# Altium project Injection_PCB.PrjPcb
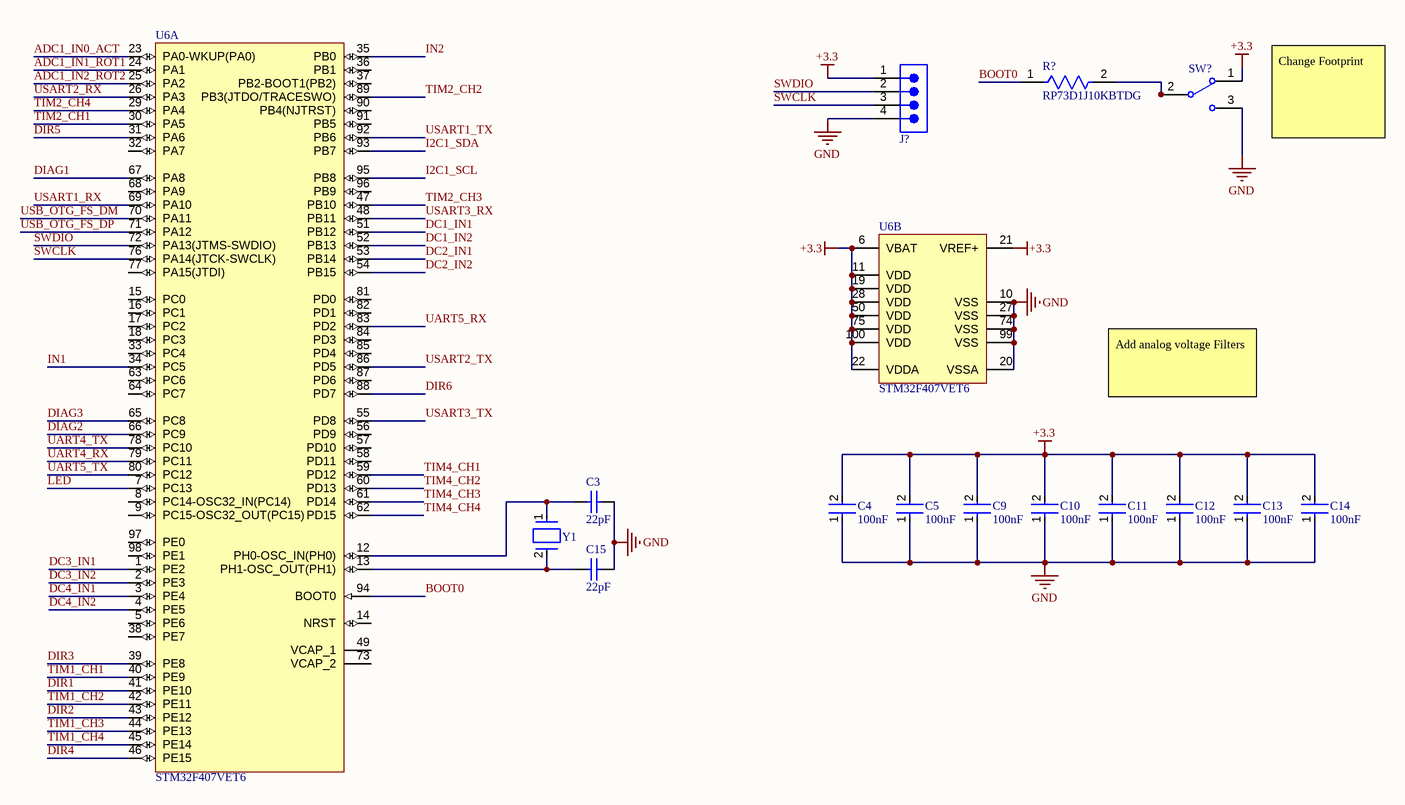
[diagram p0: MCU.SchDoc]
4 sheets, 79 parts. Net scope: global (net labels, ports and power ports of the same name join across sheets).
Board file: Injection_PCB.PcbDoc
Sheets:
  MCU.SchDoc
  Power.SchDoc
  Motor_Drivers.SchDoc
  Encoders.SchDoc

## Sheet MCU.SchDoc
size 431 x 279 mm; SheetNumber: 1; SheetTotal: 4

### Parts
C3  Capacitance: 22pF  [CAPC1608X90X35ML10T15]  (hidden comment: GRM1885C1H220JA01D)
C4  Capacitance: 100nF  [FP-CGA3E-0_3-0_1-IPC_A]  (hidden comment: CGA3E2X7R1H104K080AA)
C5  Capacitance: 100nF  [FP-CGA3E-0_3-0_1-IPC_A]  (hidden comment: CGA3E2X7R1H104K080AA)
C9  Capacitance: 100nF  [FP-CGA3E-0_3-0_1-IPC_A]  (hidden comment: CGA3E2X7R1H104K080AA)
C10  Capacitance: 100nF  [FP-CGA3E-0_3-0_1-IPC_A]  (hidden comment: CGA3E2X7R1H104K080AA)
C11  Capacitance: 100nF  [FP-CGA3E-0_3-0_1-IPC_A]  (hidden comment: CGA3E2X7R1H104K080AA)
C12  Capacitance: 100nF  [FP-CGA3E-0_3-0_1-IPC_A]  (hidden comment: CGA3E2X7R1H104K080AA)
C13  Capacitance: 100nF  [FP-CGA3E-0_3-0_1-IPC_A]  (hidden comment: CGA3E2X7R1H104K080AA)
C14  Capacitance: 100nF  [FP-CGA3E-0_3-0_1-IPC_A]  (hidden comment: CGA3E2X7R1H104K080AA)
C15  Capacitance: 22pF  [CAPC1608X90X35ML10T15]  (hidden comment: GRM1885C1H220JA01D)
J?  61300411121  [61300411121]  (value not drawn)
R?  RP73D1J10KBTDG  [FP-RP731J-MFG]
SW?  EG1218  [ESWI-EG1218_V]  (value not drawn)
U6  STM32F407VET6  [STM-LQFP100_M]  (parts A,B of 2)
Y1  ABLS-8.000MHZ-B2-T  [FP-ABLS-MFG]  (value not drawn)

### Nets
+3.3: C4.2 C5.2 C9.2 C10.2 C11.2 C12.2 C13.2 C14.2 J?.1 SW?.1 U6.6(VBAT) U6.11(VDD) U6.19(VDD) U6.21(VREF+) U6.22(VDDA) U6.28(VDD) U6.50(VDD) U6.75(VDD) U6.100(VDD)
GND: C3.1 C4.1 C5.1 C9.1 C10.1 C11.1 C12.1 C13.1 C14.1 C15.1 J?.4 SW?.3 U6.10(VSS) U6.20(VSSA) U6.27(VSS) U6.74(VSS) U6.99(VSS)
ADC1_IN0_ACT: U6.23(PA0-WKUP(PA0))
ADC1_IN1_ROT1: U6.24(PA1)
ADC1_IN2_ROT2: U6.25(PA2)
BOOT0: R?.1 U6.94(BOOT0)
DC1_IN1: U6.51(PB12)
DC1_IN2: U6.52(PB13)
DC2_IN1: U6.53(PB14)
DC2_IN2: U6.54(PB15)
DC3_IN1: U6.1(PE2)
DC3_IN2: U6.2(PE3)
DC4_IN1: U6.3(PE4)
DC4_IN2: U6.4(PE5)
DIAG1: U6.67(PA8)
DIAG2: U6.66(PC9)
DIAG3: U6.65(PC8)
DIR1: U6.41(PE10)
DIR2: U6.43(PE12)
DIR3: U6.39(PE8)
DIR4: U6.46(PE15)
DIR5: U6.31(PA6)
DIR6: U6.88(PD7)
I2C1_SCL: U6.95(PB8)
I2C1_SDA: U6.93(PB7)
IN1: U6.34(PC5)
IN2: U6.35(PB0)
LED: U6.7(PC13)
SWCLK: J?.3 U6.76(PA14(JTCK-SWCLK))
SWDIO: J?.2 U6.72(PA13(JTMS-SWDIO))
TIM1_CH1: U6.40(PE9)
TIM1_CH2: U6.42(PE11)
TIM1_CH3: U6.44(PE13)
TIM1_CH4: U6.45(PE14)
TIM2_CH1: U6.30(PA5)
TIM2_CH2: U6.89(PB3(JTDO/TRACESWO))
TIM2_CH3: U6.47(PB10)
TIM2_CH4: U6.29(PA4)
TIM4_CH1: U6.59(PD12)
TIM4_CH2: U6.60(PD13)
TIM4_CH3: U6.61(PD14)
TIM4_CH4: U6.62(PD15)
UART4_RX: U6.79(PC11)
UART4_TX: U6.78(PC10)
UART5_RX: U6.83(PD2)
UART5_TX: U6.80(PC12)
USART1_RX: U6.69(PA10)
USART1_TX: U6.92(PB6)
USART2_RX: U6.26(PA3)
USART2_TX: U6.86(PD5)
USART3_RX: U6.48(PB11)
USART3_TX: U6.55(PD8)
USB_OTG_FS_DM: U6.70(PA11)
USB_OTG_FS_DP: U6.71(PA12)
NetC3_2: C3.2 U6.12(PH0-OSC_IN(PH0)) Y1.1
NetC15_2: C15.2 U6.13(PH1-OSC_OUT(PH1)) Y1.2
NetR?_2: R?.2 SW?.2(COM)

Not connected (* = marked no-connect by the designer): U6 5(PE6) 8(PC14-OSC32_IN(PC14)) 9(PC15-OSC32_OUT(PC15)) 14(NRST) 15(PC0) 16(PC1) 17(PC2) 18(PC3) 32(PA7) 33(PC4) 36(PB1) 37(PB2-BOOT1(PB2)) 38(PE7) 49(VCAP_1) 56(PD9) 57(PD10) 58(PD11) 63(PC6) 64(PC7) 68(PA9) 73(VCAP_2) 77(PA15(JTDI)) 81(PD0) 82(PD1) 84(PD3) 85(PD4) 87(PD6) 90(PB4(NJTRST)) 91(PB5) 96(PB9) 97(PE0) 98(PE1)

### Notes on the sheet
- Change Footprint
- Add analog voltage Filters
- DWG. NO.
- REV.
- SHT.
- THIS DOCUMENT AND THE DATA DISCLOSED HEREIN OR HEREWITH IS THE PROPERTY OF ALTIUM LIMITED AND MAY BE FREELY DISTRIBUTED IN WHOLE. NO RIGHTS ARE RESERVED OR EXPRESS OR IMPLIED WARANTEE GIVEN.
- REVISION
- DESCRIPTION
- DATE
- APPROVED
- ENG:
- APPROVALS
- PROJECT
- DSN:
- CHK:
- REFERENCE DOCUMENTS
- PROJECT REVISION:
- TITLE
- DOCUMENT REVISION:
- DESIGN ITEM:
- BOM:
- FAB DWG:
- PCB DWG:
- ASSY DWG:
- SCALE:
- SIZE
- B
- CAGE CODE
- FILE NAME
- DWG NO.
- SHEET
- OF
- REV

### Library data of the parts
C3 C15 = CMP-2000-04945-1: Chip Capacitor, 22 pF, +/- 5%, 50 V, -55 to 125 degC, 0603 (1608 Metric), RoHS, Tape and Reel; Manufacturer: Murata; Rated Voltage: 50V; Dielectric: C0G; Manufacturer URL: http://www.murata.com/; Datasheet Version: Jul-06; Package Reference: 603; Tolerance (%): ±5%; Case Size/Dimension: 0603; Package Description: 2-Pin Surface Mount Device, Body 1.6 x 0.8 mm; Datasheet URL: https://datasheet.ciiva.com/11786/0900766b807a1cab-11786398.pdf
C4 C5 C9-C14 = CMP-2000-07546-2: Cap Ceramic 100nF 50V X7R 10% Pad SMD 0603 +125°C Automotive T/R; Weight: 7.1E-05oz; Composition: Ceramic; Max Operating Temperature: 125°C; Termination: SMD/SMT; Dielectric: X7R; Length: 1.6mm; Package Quantity: 1; REACH SVHC: No SVHC; Lead Free: Lead Free; Case Code (Metric): 1608; Min Operating Temperature: -55°C; Packaging: Tape and Reel; Tolerance: 10%; Voltage Rating: 50V; Case Code (Imperial): 0603; Case/Package: 0603; Voltage Rating (DC): 50V; Depth: 0.8mm; Radiation Hardening: No; Ratings: AEC-Q200; Mount: Surface Mount; Voltage: 50V; Thickness: 0.035inch; Width: 0.8mm; Height: 0.8mm; LCSC: C14663
J? = CMP-1502-01064-3: NexarPartId: 32855522; Operating Supply Voltage: 250V; Pitch: 2.54mm; Contact Resistance: 20mΩ; Number of Positions: 4; Current Rating: 3A; Connector Type: Male Pin; Gender: Male; Contact Plating: Gold; Height: 8.89mm; Lead Pitch: 2.54mm; Lead Free: Lead Free; Contact Mating Length: 5.9944mm; Number of Rows: 1; Termination: Solder; Packaging: Bulk; REACH SVHC: Unknown; Min Operating Temperature: -40°C; RoHS: Compliant; Number of Contacts: 4; Voltage Rating: 250V; Color: Black; Max Operating Temperature: 105°C; Contact Material: Copper; Mount: Through Hole; Orientation: Vertical; Number of Pins: 4
R? = CMP-03211-006887-1: TE CONNECTIVITY / HOLSWORTHY SMD Chip Resistor, Thin Film, 10KΩ, 50 V, 0603 [1608 Metric], 100 mW, 0.1% , RP73 Series; Voltage Rating: 75V; Power Rating: 0.1W; Temperature Coefficient: 15ppm/°C; Lead Free: Yes; Tolerance: 0.1%; Category: Res; Ipc Land Pattern Name: RESC15580X45; Composition: Thin Film; octopart_url: https://octopart.com/rp73d1j10kbtdg-te+connectivity-42631518; ComponentLink2URL: https://www.te.com/commerce/DocumentDelivery/DDEController?Action=srchrtrv&DocNm=1773272&DocType=DS&DocLang=English; Device Class L1: Passive Components; packaging: cut tape; Device Class L3: Chip SMD Resistors; Temperature Range Low: -55°C; Package: RP731J; Value: 10KΩ; ComponentLink2Description: Datasheet; RoHS: TRUE; Temperature: -55°C to +105°C; Height: 0.55mm; Automotive: No; Resistance: 10KΩ; Series: RP73; Octopart: https://octopart.com/rp73d1j10kbtdg-te+connectivity-42631518; Manufacturer: TE Connectivity; Temperature Range High: +105°C; Manufacturer Part Number: RP73D1J10KBTDG; Device Class L2: Resistors
SW? = CMP-1696-00002-1: Slide Switch, 500 V, -20 to 70 degC, 3-Pin THD, RoHS; Case\Package: SOT-23-5; Output Current: 150 mA; Nominal Output Voltage: 3.3 V; Max Power Dissipation: 250 mW; Min Input Voltage: 4.3 V; Outputs: 1; Max Input Voltage: 8 V; Dropout Voltage: 300 mV; PackageDescription: 3-Pin Through Hole Device, Body 11.6 x 4 mm, Pitch 2.5 mm; ComponentLink1URL: http://www.e-switch.ch/en/; RoHSCompliant: true; Length: 3 mm; ComponentLink1Description: Manufacturer URL; Power Rating: 250 mW; Mount: Surface Mount; Max Operating Temperature: 85 degC; REACH SVHC: No SVHC; Radiation Hardening: No; Height: 1.3 mm; Pins: 5; Max Ouput Current: 150 mA; Output Voltage: 3.3 V; Width: 1.8 mm; Package Quantity: 3000; ComponentLink2URL: https://www.e-switch.com/system/asset/product_line/data_sheet/119/EG.pdf; Min Operating Temperature: -40 degC; ComponentLink2Description: Datasheet; DatasheetVersion: Oct-15; PackageReference: EG1218; Packaging: Tape and Reel
U6 = CMP-0243-00016-3: ARM Cortex-M4 32-bit MCU+FPU, 210 DMIPS, 512 kB Flash, 192 kB Internal RAM, 82 I/Os, 100-pin LQFP, -40 to 85 degC, Tray; Manufacturer: STMicroelectronics; Supply Voltage(Vcc) max (V): 3.6; Supply Voltage(Vcc) min (V): 1.8; I/Os (High Current): 82; FLASH Size (Prog) (kB): 512; Operating Frequency(F) (Processor speed) (MHz): 168; D/A Converter: 2x12-bit; Internal RAM Size (kB): 192; PackageReference: LQFP100; Core: ARM Cortex-M4; ComponentLink1URL: http://www.st.com/web/en/home.html; ComponentLink1Description: Manufacturer URL; DatasheetVersion: Rev. 4; Packing: Tray; Mounting Technology: Surface Mount; ComponentLink2Description: Datasheet; ComponentLink2URL: http://www.st.com/st-web-ui/static/active/en/resource/technical/document/datasheet/DM00037051.pdf; ComponentLink3Description: Package Specification; PartNumber: STM32F407VET6; PackageVersion: Rev. 1, 06/2013; PackageDescription: 100-Pin Low Profile Quad Flat Package, 14 x 14 mm Body, 0.5 mm Pitch; ComponentLink3URL: http://www.st.com/st-web-ui/static/active/en/resource/technical/document/data_brief/DM00071938.pdf; LCSC: C28730
Y1 = CMP-27762-009874-1: CRYSTAL 8.0000MHZ 18PF SMD; ESR (Equivalent Series Resistance): 80R; Operating Frequency: 8 MHz; Frequency Stability: 50ppm; Tolerance: 20ppm; Frequency: 8MHz; Min Operating Temperature: -20°C; Lead Free: Lead Free; Width: 4.7mm; Packaging: Tape and Reel; Series: ABLS; Accuracy: 20ppm; Length: 11.4mm; Frequency Tolerance: 20ppm; Termination: SMD/SMT; Number of Pins: 2; Radiation Hardening: No; Depth: 4.7mm; REACH SVHC: No SVHC; Contact Plating: Tin; Load Capacitance: 18pF; Case/Package: SMD/SMT; Mount: Surface Mount; Package Quantity: 1000; Max Operating Temperature: 70°C; Height: 0.165inch; Series Resistance: 80R

## Sheet Power.SchDoc
size 431 x 279 mm; SheetNumber: 2; SheetTotal: 4
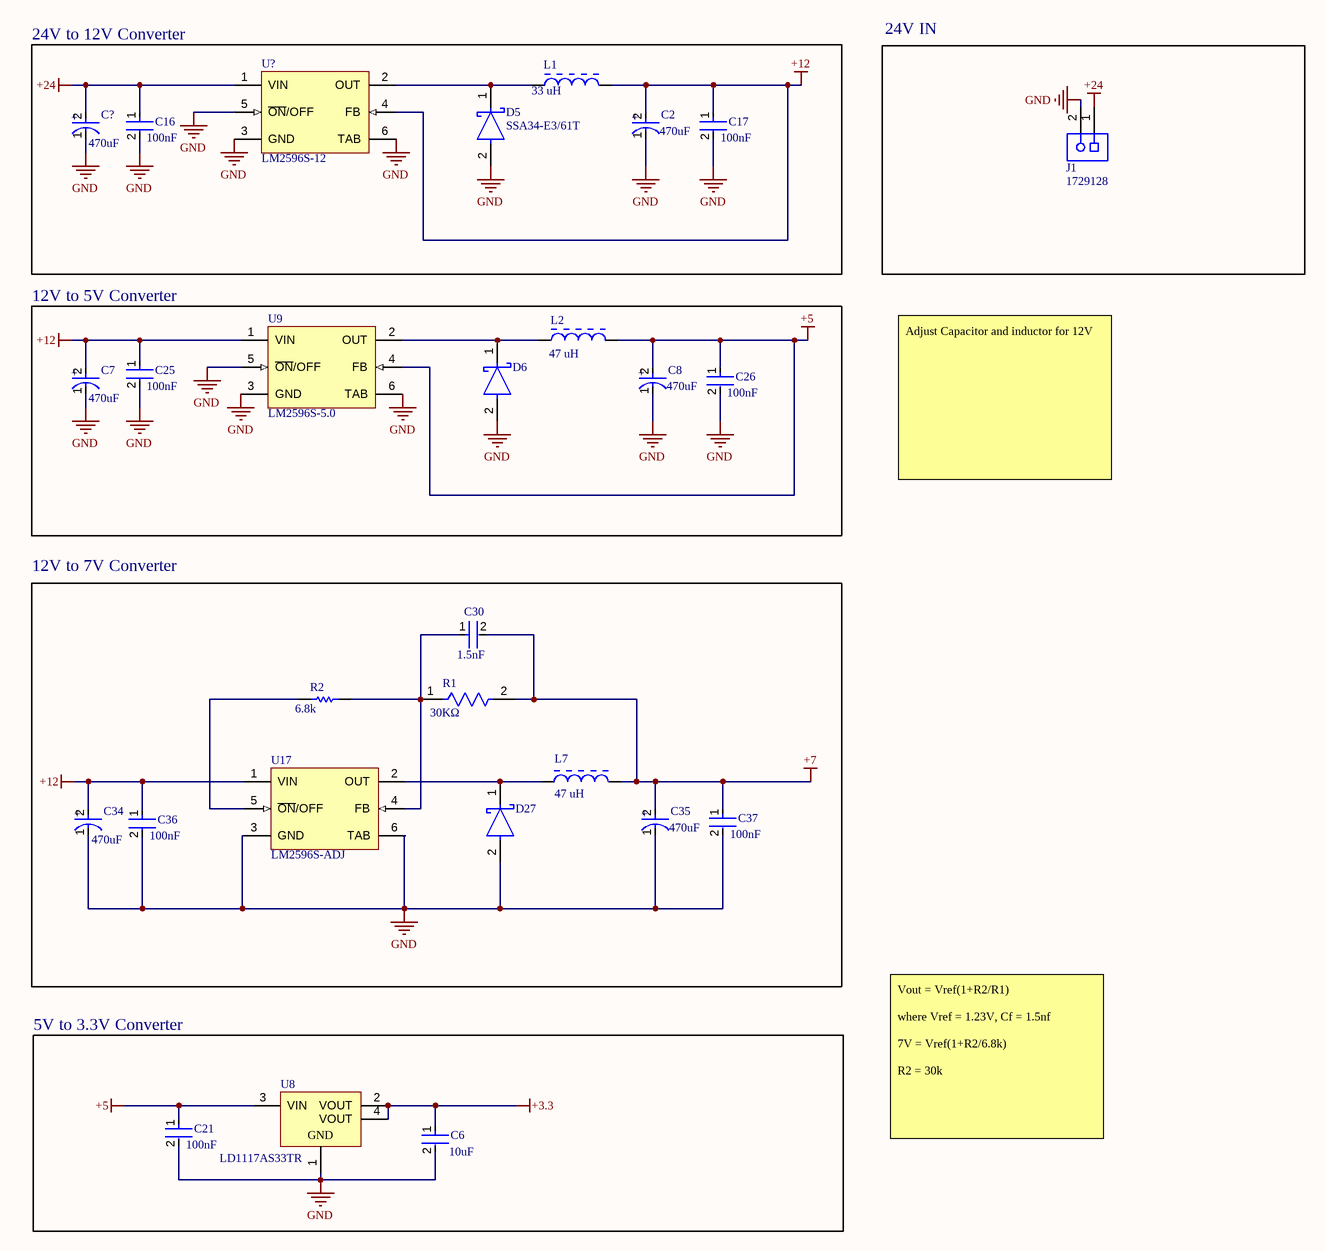
[diagram p1: Power.SchDoc]

### Parts
C2  Capacitance: 470uF  [FP-FTF-MFG]  (hidden comment: EEEFT1E471AP)
C6  Capacitance: 10uF  [FP-GRM188-0_1-e0_2_0_55-IPC_A]  (hidden comment: GRM188R60J106ME47D)
C7  Capacitance: 470uF  [FP-FTF-MFG]  (hidden comment: EEEFT1E471AP)
C8  Capacitance: 470uF  [FP-FTF-MFG]  (hidden comment: EEEFT1E471AP)
C16  Capacitance: 100nF  [FP-CGA3E-0_3-0_1-IPC_A]  (hidden comment: CGA3E2X7R1H104K080AA)
C17  Capacitance: 100nF  [FP-CGA3E-0_3-0_1-IPC_A]  (hidden comment: CGA3E2X7R1H104K080AA)
C21  Capacitance: 100nF  [FP-CGA3E-0_3-0_1-IPC_A]  (hidden comment: CGA3E2X7R1H104K080AA)
C25  Capacitance: 100nF  [FP-CGA3E-0_3-0_1-IPC_A]  (hidden comment: CGA3E2X7R1H104K080AA)
C26  Capacitance: 100nF  [FP-CGA3E-0_3-0_1-IPC_A]  (hidden comment: CGA3E2X7R1H104K080AA)
C30  Capacitance: 1.5nF  [FP-0603-L_1_6_0_1-W_0_8_0-IPC_A]  (hidden comment: UMK107SD152KA-T)
C34  Capacitance: 470uF  [FP-FTF-MFG]  (hidden comment: EEEFT1E471AP)
C35  Capacitance: 470uF  [FP-FTF-MFG]  (hidden comment: EEEFT1E471AP)
C36  Capacitance: 100nF  [FP-CGA3E-0_3-0_1-IPC_A]  (hidden comment: CGA3E2X7R1H104K080AA)
C37  Capacitance: 100nF  [FP-CGA3E-0_3-0_1-IPC_A]  (hidden comment: CGA3E2X7R1H104K080AA)
C?  Capacitance: 470uF  [FP-FTF-MFG]  (hidden comment: EEEFT1E471AP)
D5  SSA34-E3/61T  [FP-95400-MFG]
D6  SSA34-E3/61T  [FP-95400-MFG]  (value not drawn)
D27  SSA34-E3/61T  [FP-95400-MFG]  (value not drawn)
J1  1729128  [PHOE-1729128-2_V]
L1  Inductance: 33 uH  [BOUR-SRN3015-2_V]  (hidden comment: SRN3015-330M)
L2  Inductance: 47 uH  [BOUR-SRN3015-2_V]  (hidden comment: SRN3015-470M)
L7  Inductance: 47 uH  [BOUR-SRN3015-2_V]  (hidden comment: SRN3015-470M)
R1  value 30KΩ  [FP-RT0603-MFG]  (hidden comment: RT0603FRE0730KL)
R2  value 6.8k  [RESC1609X50X30LL10T20]  (hidden comment: CRCW06036K80FKEA)
U8  LD1117AS33TR  [SOT-223_M]
U9  LM2596S-5.0  [KTT0005B_L]
U17  LM2596S-ADJ  [TS5B_L]
U?  LM2596S-12  [TS5B_N]

### Blocks framed on the sheet
24V to 12V Converter: C2 C16 C17 C? D5 L1 U?
24V IN: J1
12V to 5V Converter: C7 C8 C25 C26 D6 L2 U9
12V to 7V Converter: C30 C34-C37 D27 L7 R1 R2 U17
5V to 3.3V Converter: C6 C21 U8

### Nets
+3.3: C6.1 U8.2(VOUT) U8.4(VOUT)
+5: C8.2(A) C21.1 C26.1 L2.2 U8.3(VIN) U9.4(FB)
+7: C30.2 C35.2(A) C37.1 L7.2 R1.2
+12: C2.2(A) C7.2(A) C17.1 C25.1 C34.2(A) C36.1 L1.2 U9.1(VIN) U17.1(VIN) U?.4(FB)
+24: C16.1 C?.2(A) J1.1 U?.1(VIN)
GND: C2.1(C) C6.2 C7.1(C) C8.1(C) C16.2 C17.2 C21.2 C25.2 C26.2 C34.1(C) C35.1(C) C36.2 C37.2 C?.1(C) D5.2(A) D6.2(A) D27.2(A) J1.2 U8.1(GND) U9.3(GND) U9.5(~{ON}/OFF) U9.6(TAB) U17.3(GND) U17.6(TAB) U?.3(GND) U?.5(~{ON}/OFF) U?.6(TAB)
NetC30_1: C30.1 R1.1 R2.2 U17.4(FB)
NetD5_1: D5.1(C) L1.1 U?.2(OUT)
NetD6_1: D6.1(C) L2.1 U9.2(OUT)
NetD27_1: D27.1(C) L7.1 U17.2(OUT)
NetR2_1: R2.1 U17.5(~{ON}/OFF)

### Notes on the sheet
- Adjust Capacitor and inductor for 12V
- Vout = Vref(1+R2/R1)
  where Vref = 1.23V, Cf = 1.5nf
  7V = Vref(1+R2/6.8k)
  R2 = 30k
- DWG. NO.
- REV.
- SHT.
- THIS DOCUMENT AND THE DATA DISCLOSED HEREIN OR HEREWITH IS THE PROPERTY OF ALTIUM LIMITED AND MAY BE FREELY DISTRIBUTED IN WHOLE. NO RIGHTS ARE RESERVED OR EXPRESS OR IMPLIED WARANTEE GIVEN.
- REVISION
- DESCRIPTION
- DATE
- APPROVED
- ENG:
- APPROVALS
- PROJECT
- DSN:
- CHK:
- REFERENCE DOCUMENTS
- PROJECT REVISION:
- TITLE
- DOCUMENT REVISION:
- DESIGN ITEM:
- BOM:
- FAB DWG:
- PCB DWG:
- ASSY DWG:
- SCALE:
- SIZE
- B
- CAGE CODE
- FILE NAME
- DWG NO.
- SHEET
- OF
- REV
- (in symbol CMP-05427-000040-1) +

### Library data of the parts
C2 C7 C8 C34 C35 C? = CMP-05427-000040-1: CAP ALUM 470UF 20% 25V SMD; ESR (Equivalent Series Resistance): 80mR; Dielectric Material: Aluminium; Lead Diameter: 0.9mm; Ripple Current: 850mA; Leakage Current: 117.5uA; Life (Hours): 2000Hour; Lead Free: Lead Free; Height - Seated (Max): 0.413inch; Contact Plating: Tin; Voltage: 25V; Package Quantity: 500; REACH SVHC: No SVHC; Diameter: 8mm; Features: General Purpose; Voltage Rating: 25V; Radiation Hardening: No; Number of Pins: 2; Length: 10.2mm; Max Operating Temperature: 105°C; Tolerance: 20%; Lead Pitch: 3.1mm; Voltage Rating (DC): 25V; Packaging: Tape and Reel; RoHS Compliant: Yes; Series: FT; Height: 10.2mm; Construction: Cylindrical; Case/Package: Radial; Mount: Surface Mount; Termination: SMD/SMT; Min Operating Temperature: -55°C; Ripple Current (AC): 850mA; LCSC: C178591
C6 = CMP-2006-02792-2: Chip Multilayer Ceramic Capacitors for General Purpose, 0603, 10uF, X5R, 15%, 20%, 6.3V; Packaging: Tape and Reel; Voltage Rating (DC): 6.3V; Width: 0.031inch; Termination: SMD/SMT; Dielectric: X5R; Package Quantity: 4000; Voltage Rating: 6.3V; Case/Package: 0603; Min Operating Temperature: -55°C; Voltage: 6.3V; Length: 1.6mm; Thickness: 0.035inch; Lead Free: Lead Free; Depth: 0.8mm; Case Code (Imperial): 0603; Max Operating Temperature: 85°C; Material: Ceramic; Height: 0.8mm; Tolerance: 20%; Mount: Surface Mount; REACH SVHC: No SVHC; Radiation Hardening: No; Case Code (Metric): 1608; LCSC: C385035
C16 C17 C21 C25 C26 C36 C37 = CMP-2000-07546-2: as C4 on sheet MCU; Weight: 7.1E-05oz; Composition: Ceramic; Max Operating Temperature: 125°C; Termination: SMD/SMT; Dielectric: X7R; Length: 1.6mm; Package Quantity: 1; REACH SVHC: No SVHC; Lead Free: Lead Free; Case Code (Metric): 1608; Min Operating Temperature: -55°C; Packaging: Tape and Reel; Tolerance: 10%; Voltage Rating: 50V; Case Code (Imperial): 0603; Case/Package: 0603; Voltage Rating (DC): 50V; Depth: 0.8mm; Radiation Hardening: No; Ratings: AEC-Q200; Mount: Surface Mount; Voltage: 50V; Thickness: 0.035inch; Width: 0.8mm; Height: 0.8mm; LCSC: C14663
C30 = CMP-14477-003947-2: None; Tolerance: 10%; Dielectric Material: Ceramic; Voltage Rating (DC): 50V; Case Code (Imperial): 0603; RoHS Compliant: Yes; Mount: Surface Mount; Packaging: Tape and Reel; Height: 0.8mm; Number of Pins: 2; Width: 0.031inch; Min Operating Temperature: -55°C; Depth: 0.8mm; Package Quantity: 4000; Termination: SMD/SMT; Halogen Free: Halogen Free; Length: 0.063inch; Max Operating Temperature: 125°C; Voltage Rating: 50V; Lead Free: Lead Free; Case Code (Metric): 1608; Radiation Hardening: No; Case/Package: 0603; Thickness: 0.035inch; Construction: Flat; Series: CFCAP™
D5 D6 D27 = CMP-02539-000022-2: DIODE SCHOTTKY 40V 3A DO214AC; Element Configuration: Single; Max Reverse Leakage Current: 200uA; Polarity: Standard; Peak Non-Repetitive Surge Current: 75A; Forward Voltage: 490mV; Radiation Hardening: No; Current Rating: 3A; Contact Plating: Tin; Output Current: 3A; Height: 2.087mm; Mount: Surface Mount; Case/Package: SMA; Packaging: Tape and Reel; Width: 2.79mm; Average Rectified Current: 3A; Max Repetitive Reverse Voltage (Vrrm): 40V; Max Operating Temperature: 150°C; Length: 4.5mm; RoHS Compliant: Yes; Max Reverse Current: 200uA; Voltage Rating (DC): 40V; Min Operating Temperature: -65°C; Max Reverse Voltage (DC): 40V; Number of Pins: 2; Max Forward Surge Current (Ifsm): 75A; Lead Free: Lead Free; Forward Current: 3A; Max Surge Current: 75A; Package Quantity: 1; LCSC: C466998
J1 = CMP-2000-05815-1: PCB Terminal Block, 13.5 A, 400 V, 2-Pin THD, RoHS, Bulk; Manufacturer: Phoenix Contact; Package Version: 03/2015; No. of Rows: 1; Pitch: 5.08mm; No. of Positions: 2; Voltage Rating: 400V; Current Rating: 13500mA; Manufacturer URL: http://www.phoenixcontact.com/; Datasheet URL: https://datasheet.ciiva.com/16046/1729128-16046181.pdf; RoHS: TRUE; Package URL: https://www.phoenixcontact.com/online/portal/pi/pxc/product_detail_page/!ut/p/b1/3VdJjqNKFDxLH8AFycySyWY2ozFsEPOMMQaDOX1XedGL_1Vdm5YXJleknhSKeBkvI6EA8ncAo3AYoDhBQGco6KN7VURTdemj9us_IEKEZo_YHiPAEWEFmDGOHMORkqKYCORBZxgL7ZoaZYcbFFUZ3fqxSY6GOuxydWUuHqz1ynmMFygu583Bob0Ewr6Sd_l-5m-kAueHiB0jpRwZwe58wwtkpxtMYd_LmGcDRU02dRNEyWt6Y2ti5pSyJ_reIkzIulrqApdnbT11V5jnCKbYNCvhEM1MCpPByat_X379-iThf08CI5GfOPqfBeS3BRoBOdD55AKVv0iLwCMq-2BrzXWSGRH7pUGD9uwXQjiph3xL0DKQwdGa0JImiIOmBNOestqgwTHSSs2oOep-78apyXQBvNi8ZLaFjvjWvcaUEBu0MC6Wbe-d6mB0FAebo2lUWinqYaZs5DAYzV0RP9yitUjnGJ0iI9xhZkT42OCQNUJJhkgWINNQLP2JFP6OpMg3JCVg70jqHT0lvKOnhHf0lPuOnnLf0VPuWx6_dxwUIvwk5WMkT0kLL1mh61l2yZVSzG3pYV_bqo-mj6uMKwKwdnnW8Jh5RTOJzMOA5c-eJDaZQw4mTMPH02PvS_ZAqNVjVTo2WyYLkwH_KU1mmmG5kjRhDqPXLwwVHvVOjCM60-fpXvTDfMGW1PVFVS1r4e4yVDk4ZdNbkUHvqPqQSeian4UD39fNKmachqdJ1NJbyk8rXT9mXTvPk3oE5meulKGgiruPJek-4I9hTT6G8ZLOyRSm2RRVbThERQad5OS28hdt4YW4vG0stgYYzsWsK4_7y6DZMjJSCqri1kyiZR5vD7pwIrNR7QwPHTcLTI5qT7eRlpHrdGiupYlqQDJ7zy_CND8fWWBoLRXxk1RVcXiBQwbTD4Xi7KL-FuO94t9xaqweXzH; PartNumber: 1729128; Package Description: 2-Pin Through Hole Device, Body 8.1 x 10.16 mm, Pitch 5.08 mm; Datasheet Version: 12/2013; Mounting Technology: ThroughHole; Orientation: Horizontal; Package Reference: 1729128-2; Packing: Bulk
L1 = CMP-0007-00002-1: Semi-shielded Power Inductor, 33 uH, +/- 20%, 0.5 A, -40 to 125 degC, 3 x 3 x 1.5 mm SMD, RoHS and Halogen Free, Tape and Reel; Manufacturer: Bourns; DCR Max: 0.959 Ohm; Resistance to Solder Heat: +260 degC for 10 sec.; Isat: 0.46 A; Rated current: 0.5 A; SRF Min: 22 MHz; Inductance tolerance: +/- 20%; Packing: Tape and Reel; PackageDescription: 2-Pin SMD, Body 3 x 3 mm, Height 1.5 mm; Operating Temperature: -40 to 125 degC; Mounting Technology: Surface Mount; ComponentLink3Description: Package Specification; DatasheetVersion: Aug-11; ComponentLink3URL: http://www.bourns.com/data/global/pdfs/SRN3015.pdf; RoHS: TRUE; PartNumber: SRN3015-330M; ComponentLink2Description: Datasheet; ComponentLink2URL: http://www.bourns.com/data/global/pdfs/SRN3015.pdf; ComponentLink1Description: Manufacturer URL; PackageReference: SRN3015; ComponentLink1URL: http://www.bourns.com/; LCSC: C2903004
L2 L7 = CMP-0007-00006-1: Semi-shielded Power Inductor, 47 uH, +/- 20%, 0.4 A, -40 to 125 degC, 3 x 3 x 1.5 mm SMD, RoHS and Halogen Free, Tape and Reel; Manufacturer: Bourns; DCR Max: 1.406 Ohm; Isat: 0.38 A; Rated current: 0.4 A; Inductance tolerance: +/- 20%; SRF Min: 18 MHz; Resistance to Solder Heat: +260 degC for 10 sec.; ComponentLink1URL: http://www.bourns.com/; ComponentLink1Description: Manufacturer URL; ComponentLink2Description: Datasheet; PackageDescription: 2-Pin SMD, Body 3 x 3 mm, Height 1.5 mm; Packing: Tape and Reel; PackageReference: SRN3015; Mounting Technology: Surface Mount; DatasheetVersion: Aug-11; RoHS: TRUE; ComponentLink3URL: http://www.bourns.com/data/global/pdfs/SRN3015.pdf; PartNumber: SRN3015-470M; ComponentLink2URL: http://www.bourns.com/data/global/pdfs/SRN3015.pdf; Operating Temperature: -40 to 125 degC; ComponentLink3Description: Package Specification; LCSC: C3222246
R1 = CMP-2000-04724-2: RES SMD 30K OHM 1% 1/10W 0603; Manufacturer: Yageo; Tolerance: 0.01; Power Rating: 0.1W; Voltage Rating: 75V; Temperature Coefficient: 50 ppm/°C; Mouser Description: Thin Film Resistors - SMD 1/10W 30K ohm 1% 50ppm; Device Class L1: Passive Components; Temperature Range High: +155°C; Manufacturer Part Number: RT0603FRE0730KL; Device Class L3: Chip SMD Resistors; Temperature: -55°C to +155°C; Resistance: 30KΩ; Octopart: https://octopart.com/rt0603fre0730kl-yageo-1290535; Series: RT; ComponentLink2URL: http://www.yageo.com/documents/recent/PYu-RT_1-to-0.01_RoHS_L_9.pdf; Ipc Land Pattern Name: RESC16080X45; Composition: Thin Film; Category: Res; Device Class L2: Resistors; Footprint Url: http://www.yageo.com/exep/pages/download/literatures/PYu-R_Mount_10.pdf; Temperature Range Low: -55°C; ComponentLink2Description: Datasheet; Package: RT0603; Lead Free: Yes; Height: 0.55mm; Digikey Description: RES SMD 30K OHM 1% 1/10W 0603; Automotive: No; RoHS: TRUE
R2 = CMP-2000-03550-1: Manufacturer: Vishay Dale; Part Number: CRCW06036K80FKEA; LCSC: C269697
U8 = CMP-0244-00316-1: 1A, Low Drop Positive Voltage Regulator, 3.3V, 4-Pin SOT-223, Tape and Reel; ComponentLink1Description: Manufacturer URL; DatasheetVersion: 2/12/2011; PackageVersion: 2010; ComponentLink1URL: http://www.st.com; ComponentLink2Description: Datasheet; ComponentLink2URL: http://www.st.com/internet/com/TECHNICAL_RESOURCES/TECHNICAL_LITERATURE/DATASHEET/CD00002116.pdf; PackageDescription: 4-Pin SOT-223 Package, 6.5 x 3.5 mm Body, 2.3 mm Pitch, 7 mm Lead Span; PackageReference: SOT-223
U9 = CMP-0069-00270-3: SIMPLE SWITCHER® Power Converter 150 KHz 3A Step-Down Voltage Regulator, 5-pin TO-263; Manufacturer: Texas Instruments; PowerWise: N; PackageTopMarking: NSUZXYTTE#*LM2596S*-5.0 P+; RoHS: N; Code_JEDEC: MO-169-AB; PackageDescription: TO-263, Molded, .400 x .390 x .180in, 5 Lead, .067in Pitch, Surface Mount; PinCount: 5; PackageReference: KTT0005B; CompType: Switcher; ComponentLink1URL: http://www.ti.com/general/docs/lit/getliterature.tsp?genericPartNumber=LM2596&fileType=pdf; ComponentLink1Description: Datasheet URL; LCSC: C347421
U17 = CMP-0069-00272-2: SIMPLE SWITCHER® Power Converter 150 KHz 3A Step-Down Voltage Regulator, 5-pin TO-263; Manufacturer: National Semiconductor; PackageTopMarking: NSUZXYTTE#*LM2596S*-ADJ P+; PowerWise: N; ComponentLink1Description: LM2596 Datasheet; RoHS: N; PackageVersion: revD, Apr-2005; DatasheetVersion: May-2002; ComponentLink2Description: LM2596 Web Page; ComponentLink2URL: http://www.national.com/pf/LM/LM2596.html; RevisionNote: Component URLs added; PackageDescription: TO-263, Molded, .400 x .390 x .180in, 5 Lead, .067in Pitch, Surface Mount; ComponentLink3Description: TS5B Package Page; ComponentLink1URL: http://www.national.com/ds/LM/LM2596.pdf; PackageReference: TS5B; Code_JEDEC: MO-169-AB; PinCount: 5; ComponentLink3URL: http://www.national.com/packaging/folders/ts5b.html; CompType: Switcher; LCSC: C5276751
U? = CMP-0069-00274-2: SIMPLE SWITCHER® Power Converter 150 KHz 3A Step-Down Voltage Regulator, 5-pin TO-263; Manufacturer: National Semiconductor; PackageTopMarking: NSUZXYTTE#*LM2596S*-12 P+; PowerWise: N; RoHS: N; ComponentLink3URL: http://www.national.com/packaging/folders/ts5b.html; DatasheetVersion: May-2002; RevisionNote: Component URLs added; CompType: Switcher; Code_JEDEC: MO-169-AB; PackageReference: TS5B; PackageDescription: TO-263, Molded, .400 x .390 x .180in, 5 Lead, .067in Pitch, Surface Mount; PackageVersion: revD, Apr-2005; ComponentLink1Description: LM2596 Datasheet; ComponentLink3Description: TS5B Package Page; ComponentLink1URL: http://www.national.com/ds/LM/LM2596.pdf; ComponentLink2URL: http://www.national.com/pf/LM/LM2596.html; ComponentLink2Description: LM2596 Web Page; PinCount: 5

## Sheet Motor_Drivers.SchDoc
size 431 x 279 mm; SheetNumber: 3; SheetTotal: 4
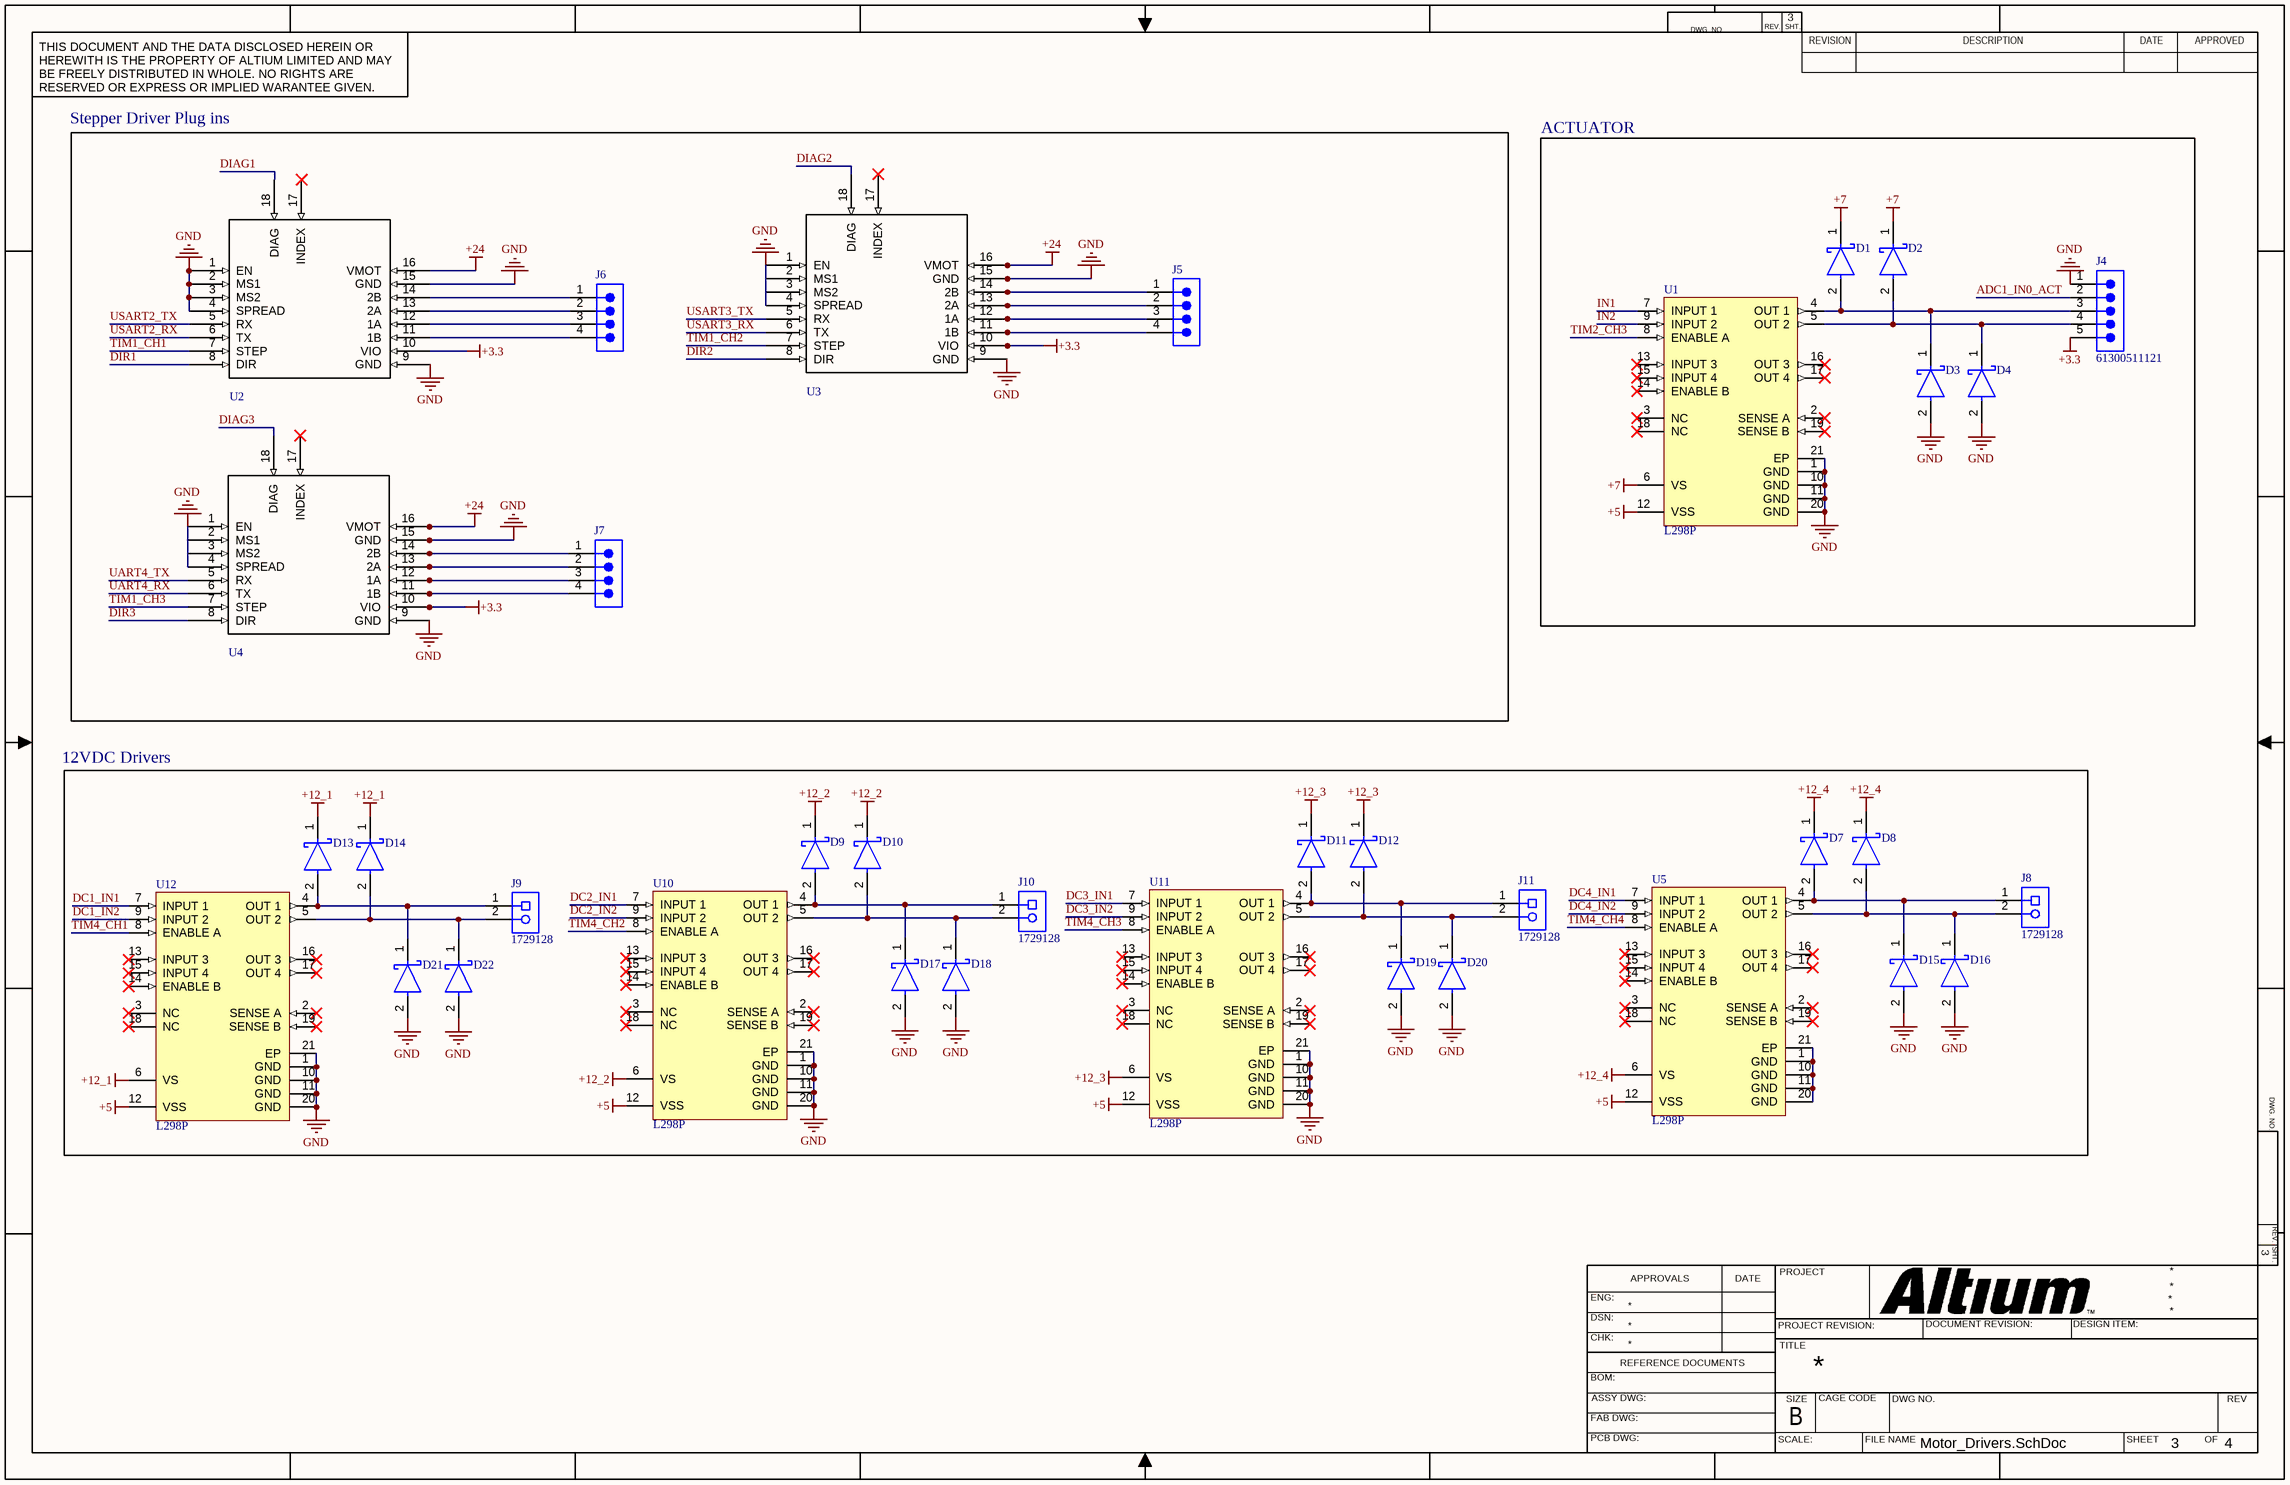
[diagram p2: Motor_Drivers.SchDoc]

### Parts
D1  SSA34-E3/61T  [FP-95400-MFG]  (value not drawn)
D2  SSA34-E3/61T  [FP-95400-MFG]  (value not drawn)
D3  SSA34-E3/61T  [FP-95400-MFG]  (value not drawn)
D4  SSA34-E3/61T  [FP-95400-MFG]  (value not drawn)
D7  SSA34-E3/61T  [FP-95400-MFG]  (value not drawn)
D8  SSA34-E3/61T  [FP-95400-MFG]  (value not drawn)
D9  SSA34-E3/61T  [FP-95400-MFG]  (value not drawn)
D10  SSA34-E3/61T  [FP-95400-MFG]  (value not drawn)
D11  SSA34-E3/61T  [FP-95400-MFG]  (value not drawn)
D12  SSA34-E3/61T  [FP-95400-MFG]  (value not drawn)
D13  SSA34-E3/61T  [FP-95400-MFG]  (value not drawn)
D14  SSA34-E3/61T  [FP-95400-MFG]  (value not drawn)
D15  SSA34-E3/61T  [FP-95400-MFG]  (value not drawn)
D16  SSA34-E3/61T  [FP-95400-MFG]  (value not drawn)
D17  SSA34-E3/61T  [FP-95400-MFG]  (value not drawn)
D18  SSA34-E3/61T  [FP-95400-MFG]  (value not drawn)
D19  SSA34-E3/61T  [FP-95400-MFG]  (value not drawn)
D20  SSA34-E3/61T  [FP-95400-MFG]  (value not drawn)
D21  SSA34-E3/61T  [FP-95400-MFG]  (value not drawn)
D22  SSA34-E3/61T  [FP-95400-MFG]  (value not drawn)
J4  61300511121  [61300511121]
J5  61300411121  [61300411121]  (value not drawn)
J6  61300411121  [61300411121]  (value not drawn)
J7  61300411121  [61300411121]  (value not drawn)
J8  1729128  [PHOE-1729128-2_V]
J9  1729128  [PHOE-1729128-2_V]
J10  1729128  [PHOE-1729128-2_V]
J11  1729128  [PHOE-1729128-2_V]
U1  L298P  [STM-PowerSO20_M]
U2  TMC2209  [TCM2209_breakout]  (value not drawn)
U3  TMC2209  [TCM2209_breakout]  (value not drawn)
U4  TMC2209  [TCM2209_breakout]  (value not drawn)
U5  L298P  [STM-PowerSO20_M]
U10  L298P  [STM-PowerSO20_M]
U11  L298P  [STM-PowerSO20_M]
U12  L298P  [STM-PowerSO20_M]

### Blocks framed on the sheet
Stepper Driver Plug ins: J5-J7 U2-U4
ACTUATOR: D1-D4 J4 U1
12VDC Drivers: D7-D22 J8-J11 U5 U10-U12

### Nets
+3.3: J4.5 U2.10(VIO) U3.10(VIO) U4.10(VIO)
+5: U1.12(VSS) U5.12(VSS) U10.12(VSS) U11.12(VSS) U12.12(VSS)
+7: D1.1(C) D2.1(C) U1.6(VS)
+12_1: D13.1(C) D14.1(C) U12.6(VS)
+12_2: D9.1(C) D10.1(C) U10.6(VS)
+12_3: D11.1(C) D12.1(C) U11.6(VS)
+12_4: D7.1(C) D8.1(C) U5.6(VS)
+24: U2.16(VMOT) U3.16(VMOT) U4.16(VMOT)
GND: D3.2(A) D4.2(A) D15.2(A) D16.2(A) D17.2(A) D18.2(A) D19.2(A) D20.2(A) D21.2(A) D22.2(A) J4.1 U1.1(GND) U1.10(GND) U1.11(GND) U1.20(GND) U1.21(EP) U2.1(EN) U2.2(MS1) U2.3(MS2) U2.4(SPREAD) U2.9(GND) U2.15(GND) U3.1(EN) U3.2(MS1) U3.3(MS2) U3.4(SPREAD) U3.9(GND) U3.15(GND) U4.1(EN) U4.2(MS1) U4.3(MS2) U4.4(SPREAD) U4.9(GND) U4.15(GND) U10.1(GND) U10.10(GND) U10.11(GND) U10.20(GND) U10.21(EP) U11.1(GND) U11.10(GND) U11.11(GND) U11.20(GND) U11.21(EP) U12.1(GND) U12.10(GND) U12.11(GND) U12.20(GND) U12.21(EP)
ADC1_IN0_ACT: J4.2
DC1_IN1: U12.7(INPUT_1)
DC1_IN2: U12.9(INPUT_2)
DC2_IN1: U10.7(INPUT_1)
DC2_IN2: U10.9(INPUT_2)
DC3_IN1: U11.7(INPUT_1)
DC3_IN2: U11.9(INPUT_2)
DC4_IN1: U5.7(INPUT_1)
DC4_IN2: U5.9(INPUT_2)
DIAG1: U2.18(DIAG)
DIAG2: U3.18(DIAG)
DIAG3: U4.18(DIAG)
DIR1: U2.8(DIR)
DIR2: U3.8(DIR)
DIR3: U4.8(DIR)
IN1: U1.7(INPUT_1)
IN2: U1.9(INPUT_2)
TIM1_CH1: U2.7(STEP)
TIM1_CH2: U3.7(STEP)
TIM1_CH3: U4.7(STEP)
TIM2_CH3: U1.8(ENABLE_A)
TIM4_CH1: U12.8(ENABLE_A)
TIM4_CH2: U10.8(ENABLE_A)
TIM4_CH3: U11.8(ENABLE_A)
TIM4_CH4: U5.8(ENABLE_A)
UART4_RX: U4.6(TX)
UART4_TX: U4.5(RX)
USART2_RX: U2.6(TX)
USART2_TX: U2.5(RX)
USART3_RX: U3.6(TX)
USART3_TX: U3.5(RX)
NetD1_2: D1.2(A) D3.1(C) J4.3 U1.4(OUT_1)
NetD2_2: D2.2(A) D4.1(C) J4.4 U1.5(OUT_2)
NetD7_2: D7.2(A) D15.1(C) J8.1 U5.4(OUT_1)
NetD8_2: D8.2(A) D16.1(C) J8.2 U5.5(OUT_2)
NetD9_2: D9.2(A) D17.1(C) J10.1 U10.4(OUT_1)
NetD10_2: D10.2(A) D18.1(C) J10.2 U10.5(OUT_2)
NetD11_2: D11.2(A) D19.1(C) J11.1 U11.4(OUT_1)
NetD12_2: D12.2(A) D20.1(C) J11.2 U11.5(OUT_2)
NetD13_2: D13.2(A) D21.1(C) J9.1 U12.4(OUT_1)
NetD14_2: D14.2(A) D22.1(C) J9.2 U12.5(OUT_2)
NetJ5_1: J5.1 U3.14(2B)
NetJ5_2: J5.2 U3.13(2A)
NetJ5_3: J5.3 U3.12(1A)
NetJ5_4: J5.4 U3.11(1B)
NetJ6_1: J6.1 U2.14(2B)
NetJ6_2: J6.2 U2.13(2A)
NetJ6_3: J6.3 U2.12(1A)
NetJ6_4: J6.4 U2.11(1B)
NetJ7_1: J7.1 U4.14(2B)
NetJ7_2: J7.2 U4.13(2A)
NetJ7_3: J7.3 U4.12(1A)
NetJ7_4: J7.4 U4.11(1B)
NetU5_1: U5.1(GND) U5.10(GND) U5.11(GND) U5.20(GND) U5.21(EP)

Not connected (* = marked no-connect by the designer): U1 2(SENSE_A)* 3(NC)* 13(INPUT_3)* 14(ENABLE_B)* 15(INPUT_4)* 16(OUT_3)* 17(OUT_4)* 18(NC)* 19(SENSE_B)*; U2 17(INDEX)*; U3 17(INDEX)*; U4 17(INDEX)*; U5 2(SENSE_A)* 3(NC)* 13(INPUT_3)* 14(ENABLE_B)* 15(INPUT_4)* 16(OUT_3)* 17(OUT_4)* 18(NC)* 19(SENSE_B)*; U10 2(SENSE_A)* 3(NC)* 13(INPUT_3)* 14(ENABLE_B)* 15(INPUT_4)* 16(OUT_3)* 17(OUT_4)* 18(NC)* 19(SENSE_B)*; U11 2(SENSE_A)* 3(NC)* 13(INPUT_3)* 14(ENABLE_B)* 15(INPUT_4)* 16(OUT_3)* 17(OUT_4)* 18(NC)* 19(SENSE_B)*; U12 2(SENSE_A)* 3(NC)* 13(INPUT_3)* 14(ENABLE_B)* 15(INPUT_4)* 16(OUT_3)* 17(OUT_4)* 18(NC)* 19(SENSE_B)*

### Notes on the sheet
- DWG. NO.
- REV.
- SHT.
- THIS DOCUMENT AND THE DATA DISCLOSED HEREIN OR HEREWITH IS THE PROPERTY OF ALTIUM LIMITED AND MAY BE FREELY DISTRIBUTED IN WHOLE. NO RIGHTS ARE RESERVED OR EXPRESS OR IMPLIED WARANTEE GIVEN.
- REVISION
- DESCRIPTION
- DATE
- APPROVED
- ENG:
- APPROVALS
- PROJECT
- DSN:
- CHK:
- REFERENCE DOCUMENTS
- PROJECT REVISION:
- TITLE
- DOCUMENT REVISION:
- DESIGN ITEM:
- BOM:
- FAB DWG:
- PCB DWG:
- ASSY DWG:
- SCALE:
- SIZE
- B
- CAGE CODE
- FILE NAME
- DWG NO.
- SHEET
- OF
- REV

### Library data of the parts
D1-D4 D7-D22 = CMP-02539-000022-2: as D5 on sheet Power; Radiation Hardening: No; Current Rating: 3A; Contact Plating: Tin; Output Current: 3A; Height: 2.087mm; Mount: Surface Mount; Case/Package: SMA; Packaging: Tape and Reel; Width: 2.79mm; Average Rectified Current: 3A; Max Repetitive Reverse Voltage (Vrrm): 40V; Max Operating Temperature: 150°C; Length: 4.5mm; RoHS Compliant: Yes; Max Reverse Current: 200uA; Voltage Rating (DC): 40V; Min Operating Temperature: -65°C; Max Reverse Voltage (DC): 40V; Number of Pins: 2; Max Forward Surge Current (Ifsm): 75A; Lead Free: Lead Free; Forward Current: 3A; Max Surge Current: 75A; Package Quantity: 1; LCSC: C466998
J4 = CMP-1502-01068-3: NexarPartId: 32855526; Connector Type: Male Pin; Gender: Male; Contact Resistance: 20mΩ; Pitch: 2.54mm; Operating Supply Voltage: 250V; Current Rating: 3A; Number of Contacts: 5; Lead Free: Lead Free; Color: Black; Packaging: Bulk; Lead Pitch: 2.54mm; Contact Material: Copper; Min Operating Temperature: -40°C; Contact Mating Length: 5.9944mm; Voltage Rating: 250V; Number of Pins: 5; Number of Positions: 5; Height: 8.89mm; Orientation: Vertical; REACH SVHC: Unknown; RoHS: Compliant; Contact Plating: Gold; Max Operating Temperature: 105°C; Mount: Through Hole; Number of Rows: 1; Termination: Solder
J5-J7 = CMP-1502-01064-3: as J? on sheet MCU; Contact Plating: Gold; Height: 8.89mm; Lead Pitch: 2.54mm; Lead Free: Lead Free; Contact Mating Length: 5.9944mm; Number of Rows: 1; Termination: Solder; Packaging: Bulk; REACH SVHC: Unknown; Min Operating Temperature: -40°C; RoHS: Compliant; Number of Contacts: 4; Voltage Rating: 250V; Color: Black; Max Operating Temperature: 105°C; Contact Material: Copper; Mount: Through Hole; Orientation: Vertical; Number of Pins: 4
J8-J11 = CMP-2000-05815-1: as J1 on sheet Power; Manufacturer URL: http://www.phoenixcontact.com/; Datasheet URL: https://datasheet.ciiva.com/16046/1729128-16046181.pdf; RoHS: TRUE; Package URL: https://www.phoenixcontact.com/online/portal/pi/pxc/product_detail_page/!ut/p/b1/3VdJjqNKFDxLH8AFycySyWY2ozFsEPOMMQaDOX1XedGL_1Vdm5YXJleknhSKeBkvI6EA8ncAo3AYoDhBQGco6KN7VURTdemj9us_IEKEZo_YHiPAEWEFmDGOHMORkqKYCORBZxgL7ZoaZYcbFFUZ3fqxSY6GOuxydWUuHqz1ynmMFygu583Bob0Ewr6Sd_l-5m-kAueHiB0jpRwZwe58wwtkpxtMYd_LmGcDRU02dRNEyWt6Y2ti5pSyJ_reIkzIulrqApdnbT11V5jnCKbYNCvhEM1MCpPByat_X379-iThf08CI5GfOPqfBeS3BRoBOdD55AKVv0iLwCMq-2BrzXWSGRH7pUGD9uwXQjiph3xL0DKQwdGa0JImiIOmBNOestqgwTHSSs2oOep-78apyXQBvNi8ZLaFjvjWvcaUEBu0MC6Wbe-d6mB0FAebo2lUWinqYaZs5DAYzV0RP9yitUjnGJ0iI9xhZkT42OCQNUJJhkgWINNQLP2JFP6OpMg3JCVg70jqHT0lvKOnhHf0lPuOnnLf0VPuWx6_dxwUIvwk5WMkT0kLL1mh61l2yZVSzG3pYV_bqo-mj6uMKwKwdnnW8Jh5RTOJzMOA5c-eJDaZQw4mTMPH02PvS_ZAqNVjVTo2WyYLkwH_KU1mmmG5kjRhDqPXLwwVHvVOjCM60-fpXvTDfMGW1PVFVS1r4e4yVDk4ZdNbkUHvqPqQSeian4UD39fNKmachqdJ1NJbyk8rXT9mXTvPk3oE5meulKGgiruPJek-4I9hTT6G8ZLOyRSm2RRVbThERQad5OS28hdt4YW4vG0stgYYzsWsK4_7y6DZMjJSCqri1kyiZR5vD7pwIrNR7QwPHTcLTI5qT7eRlpHrdGiupYlqQDJ7zy_CND8fWWBoLRXxk1RVcXiBQwbTD4Xi7KL-FuO94t9xaqweXzH; PartNumber: 1729128; Package Description: 2-Pin Through Hole Device, Body 8.1 x 10.16 mm, Pitch 5.08 mm; Datasheet Version: 12/2013; Mounting Technology: ThroughHole; Orientation: Horizontal; Package Reference: 1729128-2; Packing: Bulk
U1 U5 U10-U12 = CMP-2100-03649-1: Dual Full-Bridge Driver, 4.5 to 7 V, -25 to 130 degC, 20-Pin SOIC, RoHS, Tube; Manufacturer: STMicroelectronics; Output Current: 2A; Collector Emitter Voltage (VCEO): 46V; Min Supply Voltage: 4.8V; Max Collector Current: 3A; Supply Voltage: 42V; Number of Channels: 2; Operating Supply Current: 13mA; Packaging: Rail/Tube; Package Reference: PowerSO20; Width: 11.1mm; Radiation Hardening: No; Height: 3.3mm; Lead Free: LeadFree; Datasheet Version: 36526.0; Datasheet URL: http://www.st.com/content/ccc/resource/technical/document/datasheet/82/cc/3f/39/0a/29/4d/f0/CD00000240.pdf/files/CD00000240.pdf/jcr:content/translations/en.CD00000240.pdf; RoHSCompliant: true; Max Supply Voltage: 46V; Output Current per Channel: 2A; Package Description: 20-Pin Small Outline Integrated Circuits, Body 15.9 x 11 mm, Pitch 1.27 mm; Case/Package: SOIC; Min Operating Temperature: -25degC; Number of Pins: 20; Length: 16mm; Max Output Current: 3A; Package Quantity: 31; Max Operating Temperature: 130degC; Mount: SurfaceMount; Manufacturer URL: http://www.st.com/; LCSC: C17179540
U2-U4 = TMC2209_plug

## Sheet Encoders.SchDoc
size A; SheetNumber: 3; SheetTotal: 3

## Nets that join several sheets
+3.3: MCU (19 pins), Power (C6.1 U8.2 U8.4), Motor_Drivers (J4.5 U2.10 U3.10 U4.10)
+5: Power (6 pins), Motor_Drivers (5 pins)
+7: Power (5 pins), Motor_Drivers (D1.1 D2.1 U1.6)
+24: Power (C16.1 C?.2 J1.1 U?.1), Motor_Drivers (U2.16 U3.16 U4.16)
GND: MCU (17 pins), Power (27 pins), Motor_Drivers (49 pins)
ADC1_IN0_ACT: MCU (U6.23), Motor_Drivers (J4.2)
DC1_IN1: MCU (U6.51), Motor_Drivers (U12.7)
DC1_IN2: MCU (U6.52), Motor_Drivers (U12.9)
DC2_IN1: MCU (U6.53), Motor_Drivers (U10.7)
DC2_IN2: MCU (U6.54), Motor_Drivers (U10.9)
DC3_IN1: MCU (U6.1), Motor_Drivers (U11.7)
DC3_IN2: MCU (U6.2), Motor_Drivers (U11.9)
DC4_IN1: MCU (U6.3), Motor_Drivers (U5.7)
DC4_IN2: MCU (U6.4), Motor_Drivers (U5.9)
DIAG1: MCU (U6.67), Motor_Drivers (U2.18)
DIAG2: MCU (U6.66), Motor_Drivers (U3.18)
DIAG3: MCU (U6.65), Motor_Drivers (U4.18)
DIR1: MCU (U6.41), Motor_Drivers (U2.8)
DIR2: MCU (U6.43), Motor_Drivers (U3.8)
DIR3: MCU (U6.39), Motor_Drivers (U4.8)
IN1: MCU (U6.34), Motor_Drivers (U1.7)
IN2: MCU (U6.35), Motor_Drivers (U1.9)
TIM1_CH1: MCU (U6.40), Motor_Drivers (U2.7)
TIM1_CH2: MCU (U6.42), Motor_Drivers (U3.7)
TIM1_CH3: MCU (U6.44), Motor_Drivers (U4.7)
TIM2_CH3: MCU (U6.47), Motor_Drivers (U1.8)
TIM4_CH1: MCU (U6.59), Motor_Drivers (U12.8)
TIM4_CH2: MCU (U6.60), Motor_Drivers (U10.8)
TIM4_CH3: MCU (U6.61), Motor_Drivers (U11.8)
TIM4_CH4: MCU (U6.62), Motor_Drivers (U5.8)
UART4_RX: MCU (U6.79), Motor_Drivers (U4.6)
UART4_TX: MCU (U6.78), Motor_Drivers (U4.5)
USART2_RX: MCU (U6.26), Motor_Drivers (U2.6)
USART2_TX: MCU (U6.86), Motor_Drivers (U2.5)
USART3_RX: MCU (U6.48), Motor_Drivers (U3.6)
USART3_TX: MCU (U6.55), Motor_Drivers (U3.5)